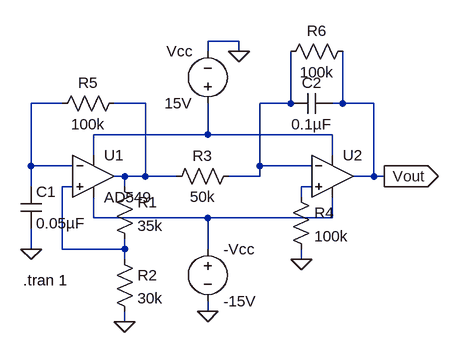
[diagram p0: schematic Q4.asc]
Q4.asc, the LTspice schematic file:
Version 4
SHEET 1 952 680
WIRE 416 -96 368 -96
WIRE 368 -80 368 -96
WIRE 416 -80 416 -96
WIRE 144 0 96 0
WIRE 272 0 224 0
WIRE 496 0 496 -80
WIRE 496 0 448 0
WIRE 576 0 576 -80
WIRE 576 0 560 0
WIRE 624 0 576 0
WIRE 368 48 368 0
WIRE 368 48 192 48
WIRE 560 48 368 48
WIRE 192 80 192 48
WIRE 560 80 560 48
WIRE 96 96 96 0
WIRE 160 96 96 96
WIRE 448 96 448 0
WIRE 528 96 448 96
WIRE 240 112 224 112
WIRE 272 112 272 0
WIRE 272 112 240 112
WIRE 320 112 272 112
WIRE 448 112 448 96
WIRE 448 112 400 112
WIRE 624 112 624 0
WIRE 624 112 592 112
WIRE 640 112 624 112
WIRE 96 128 96 96
WIRE 160 128 144 128
WIRE 240 128 240 112
WIRE 528 128 512 128
WIRE 512 144 512 128
WIRE 192 176 192 144
WIRE 368 176 192 176
WIRE 560 176 560 144
WIRE 560 176 368 176
WIRE 96 224 96 192
WIRE 144 224 144 128
WIRE 240 224 240 208
WIRE 240 224 144 224
WIRE 368 224 368 176
WIRE 240 240 240 224
WIRE 512 240 512 224
WIRE 368 320 368 304
WIRE 240 336 240 320
FLAG 512 240 0
FLAG 96 224 0
FLAG 240 336 0
FLAG 640 112 Vout
IOPIN 640 112 Out
FLAG 416 -80 0
FLAG 368 320 0
SYMBOL Opamps\\UniversalOpamp2 560 112 R0
SYMATTR InstName U2
SYMBOL res 224 112 R0
SYMATTR InstName R1
SYMATTR Value 35k
SYMBOL res 224 224 R0
SYMATTR InstName R2
SYMATTR Value 30k
SYMBOL res 416 96 R90
WINDOW 0 0 56 VBottom 2
WINDOW 3 32 56 VTop 2
SYMATTR InstName R3
SYMATTR Value 50k
SYMBOL res 496 128 R0
SYMATTR InstName R4
SYMATTR Value 100k
SYMBOL res 240 -16 R90
WINDOW 0 0 56 VBottom 2
WINDOW 3 32 56 VTop 2
SYMATTR InstName R5
SYMATTR Value 100k
SYMBOL cap 80 128 R0
SYMATTR InstName C1
SYMATTR Value 0.05µF
SYMBOL cap 560 -16 R90
WINDOW 0 0 32 VBottom 2
WINDOW 3 32 32 VTop 2
SYMATTR InstName C2
SYMATTR Value 0.1µF
SYMBOL voltage 368 16 R180
WINDOW 0 24 96 Left 2
WINDOW 3 24 16 Left 2
SYMATTR InstName Vcc
SYMATTR Value 15V
SYMBOL voltage 368 208 R0
SYMATTR InstName -Vcc
SYMATTR Value -15V
SYMBOL Opamps\\AD549 192 48 R0
SYMATTR InstName U1
SYMBOL res 592 -96 R90
WINDOW 0 0 56 VBottom 2
WINDOW 3 32 56 VTop 2
SYMATTR InstName R6
SYMATTR Value 100k
TEXT 84 272 Left 2 !.tran 1

The netlist it stands for:
* Q4.asc
XU2 N006 N003 N004 N007 Vout level.2 Avol=1Meg GBW=10Meg Slew=10Meg ilimit=25m rail=0 Vos=0 phimargin=45 en=0 enk=0 in=0 ink=0 Rin=500Meg  ; pins IN+ IN- V+ V- OUT
R1 N002 N005 35k
R2 N005 0 30k
R3 N003 N002 50k
R4 N006 0 100k
R5 N002 N001 100k
C1 N001 0 0.05µF
C2 Vout N003 0.1µF
Vcc N004 0 15V
V§-Vcc N007 0 -15V
XU1 N005 N001 N004 N007 N002 AD549  ; pins In+ In- V+ V- OUT
R6 Vout N003 100k
.tran 1
.lib UniversalOpamps2.sub
.backanno
.end